# Altium schematic sheet My_STM32_BOARD_ARDUINO_SCH.SchDoc
size A4
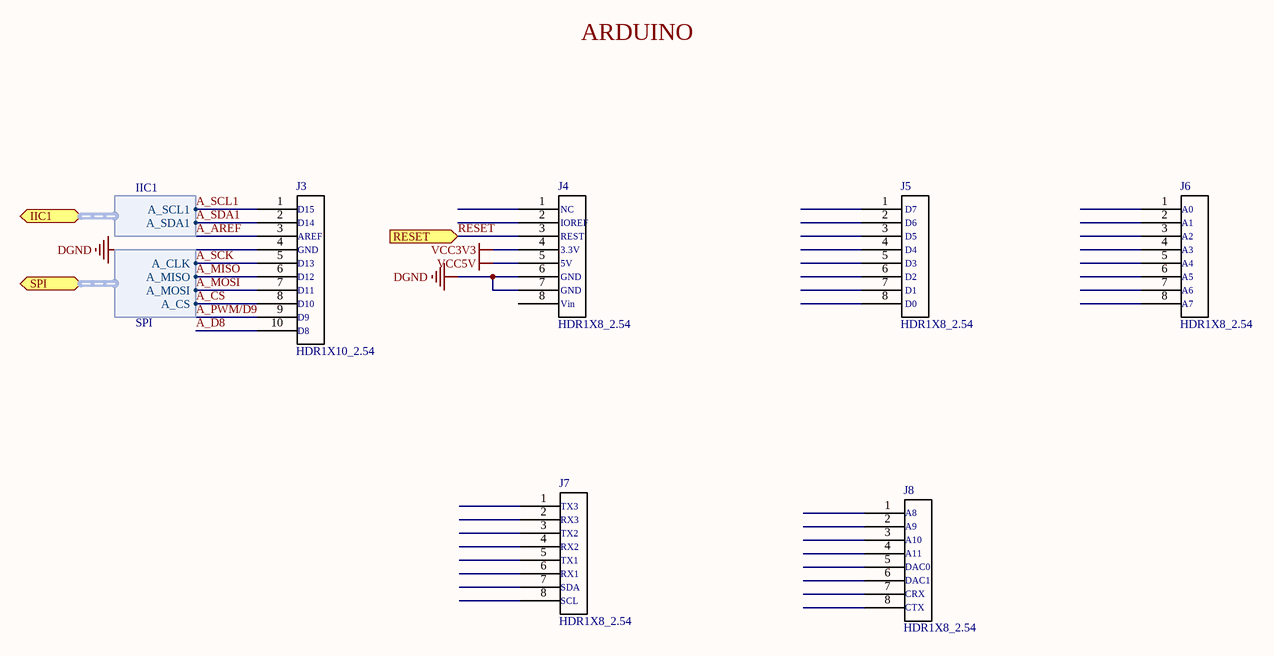
[diagram p0: My_STM32_BOARD_ARDUINO_SCH.SchDoc]

## Parts
J3  HDR1X10_2.54  [HDR1X10_2.54_180]
J4  HDR1X8_2.54  [HDR1X8_2.54_180]
J5  HDR1X8_2.54  [HDR1X8_2.54_180]
J6  HDR1X8_2.54  [HDR1X8_2.54_180]
J7  HDR1X8_2.54  [HDR1X8_2.54_180]
J8  HDR1X8_2.54  [HDR1X8_2.54_180]

## Ports
IIC1 (harness IIC1), RESET (in), SPI (harness SPI)

## Harnesses
IIC1: A_SCL1, A_SDA1
SPI: A_CLK, A_MISO, A_MOSI, A_CS

## Nets
DGND: J3.4 J4.6 J4.7
VCC3V3: J4.4
VCC5V: J4.5
A_AREF: J3.3
A_CS: J3.8 ; port SPI.A_CS
A_D8: J3.10
A_MISO: J3.6 ; port SPI.A_MISO
A_MOSI: J3.7 ; port SPI.A_MOSI
A_PWM/D9: J3.9
A_SCK: J3.5 ; port SPI.A_CLK
A_SCL1: J3.1 ; port IIC1.A_SCL1
A_SDA1: J3.2 ; port IIC1.A_SDA1
RESET: J4.3 ; port RESET

Not connected (* = marked no-connect by the designer): J4 1 2 8; J5 1 2 3 4 5 6 7 8; J6 1 2 3 4 5 6 7 8; J7 1 2 3 4 5 6 7 8; J8 1 2 3 4 5 6 7 8

## Notes on the sheet
- ARDUINO
- (near J3) D15
- (near J3) D14
- (near J3) AREF
- (near J3) GND
- (near J4) 3.3V
- (near J4) REST
- (near J4) IOREF
- (near J4) NC
- (near J5) D4
- (near J5) D5
- (near J5) D6
- (near J5) D7
- (near J6) A0
- (near J6) A1
- (near J6) A2
- (near J6) A3
- (near J3) D8
- (near J3) D9
- (near J3) D10
- (near J3) D11
- (near J3) D12
- (near J3) D13
- (near J4) Vin
- (near J4) GND
- (near J4) 5V
- (near J5) D0
- (near J5) D1
- (near J5) D2
- (near J5) D3
- (near J6) A4
- (near J6) A5
- (near J6) A6
- (near J6) A7
- (near J7) TX3
- (near J7) RX3
- (near J8) A8
- (near J8) A9
- (near J7) TX1
- (near J7) TX2
- (near J7) RX1
- (near J7) RX2
- (near J7) SCL
- (near J7) SDA
- (near J8) A10
- (near J8) A11
- (near J8) DAC0
- (near J8) DAC1
- (near J8) CRX
- (near J8) CTX